# Altium schematic sheet Bridge & Switching.SchDoc: FER_TEMPLATE
size A4; Author: Leon Baždar; CompanyName: FER; Address1: Zagreb; SheetNumber: 5; SheetTotal: 7
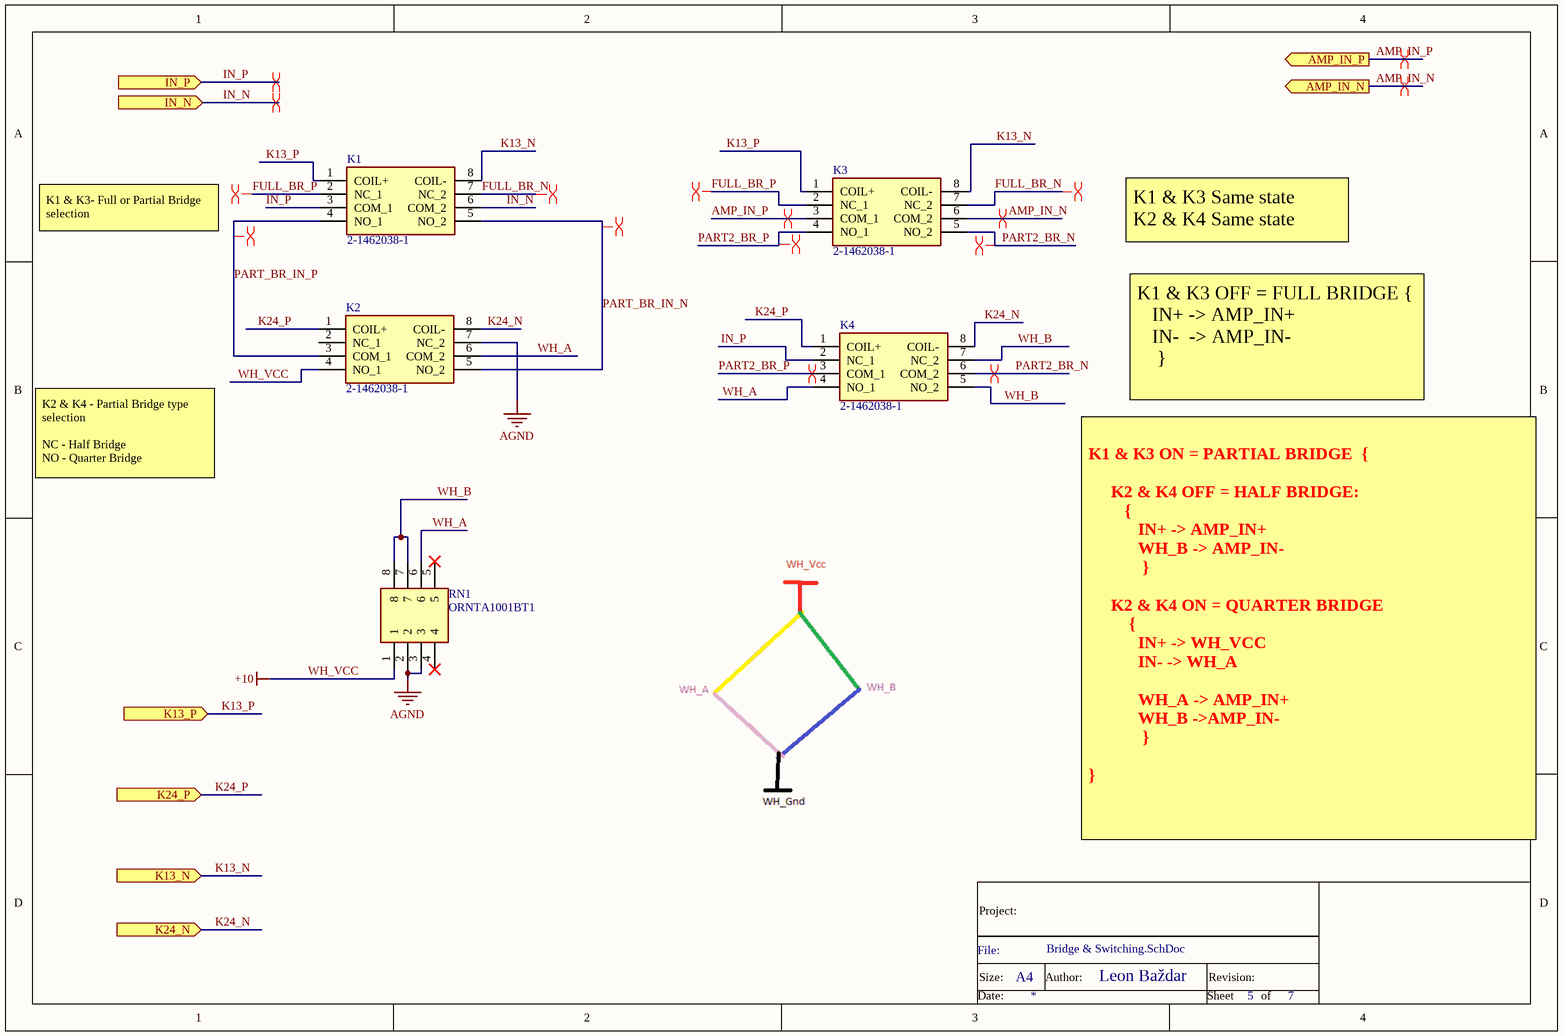
[diagram p0: Bridge & Switching.SchDoc]

## Parts
K1  2-1462038-1  [214620381]
K2  2-1462038-1  [214620381]
K3  2-1462038-1  [214620381]
K4  2-1462038-1  [214620381]
RN1  ORNTA1001BT1  [SOIC127P607X173-8N]

## Ports
AMP_IN_N (out), AMP_IN_P (out), IN_N (in), IN_P (in), K13_N (in), K13_P (in), K24_N (in), K24_P (in)

## Nets
AGND: K2.7(NC_2) RN1.2 RN1.3
WH_VCC: K2.4(NO_1) RN1.1  [also labelled +10]
AMP_IN_N: K3.6(COM_2) ; port AMP_IN_N
AMP_IN_P: K3.3(COM_1) ; port AMP_IN_P
FULL_BR_N: K1.7(NC_2) K3.7(NC_2)
FULL_BR_P: K1.2(NC_1) K3.2(NC_1)
IN_N: K1.6(COM_2) ; port IN_N
IN_P: K1.3(COM_1) K4.2(NC_1) ; port IN_P
K13_N: K1.8(COIL-) K3.8(COIL-) ; port K13_N
K13_P: K1.1(COIL+) K3.1(COIL+) ; port K13_P
K24_N: K2.8(COIL-) K4.8(COIL-) ; port K24_N
K24_P: K2.1(COIL+) K4.1(COIL+) ; port K24_P
PART2_BR_N: K3.5(NO_2) K4.6(COM_2)
PART2_BR_P: K3.4(NO_1) K4.3(COM_1)
PART_BR_IN_N: K1.5(NO_2) K2.5(NO_2)
PART_BR_IN_P: K1.4(NO_1) K2.3(COM_1)
WH_A: K2.6(COM_2) K4.4(NO_1) RN1.6
WH_B: K4.5(NO_2) K4.7(NC_2) RN1.7 RN1.8

Not connected (* = marked no-connect by the designer): K2 2(NC_1); RN1 4* 5*

## Layout directives
differential pair: AMP_IN_N, AMP_IN_P, FULL_BR_N, FULL_BR_P, IN_N, IN_P, PART2_BR_N, PART2_BR_P, PART_BR_IN_N, PART_BR_IN_P

## Notes on the sheet
- K1 & K3- Full or Partial Bridge selection
- K1 & K3 Same state
  K2 & K4 Same state
- K1 & K3 OFF = FULL BRIDGE {
  IN+ -> AMP_IN+
  IN-  -> AMP_IN-
  }
- K2 & K4 - Partial Bridge type selection
  NC - Half Bridge
  NO - Quarter Bridge
- K1 & K3 ON = PARTIAL BRIDGE  {
  K2 & K4 OFF = HALF BRIDGE:
  {
  IN+ -> AMP_IN+
  WH_B -> AMP_IN-
  }
  K2 & K4 ON = QUARTER BRIDGE
  {
  IN+ -> WH_VCC
  IN- -> WH_A
  WH_A -> AMP_IN+
  WH_B ->AMP_IN-
  }
  }
- Project:
- File:
- Size:
- A4
- Author:
- Revision:
- Date:
- Sheet
- of

## Library data of the parts
K1-K4 = 2-1462038-1: Relay or Contactor; Manufacturer_Name: TE Connectivity; Datasheet Link: https://www.te.com/commerce/DocumentDelivery/DDEController?Action=srchrtrv&DocNm=108-98001&DocType=Data+Sheet&DocLang=English&PartCntxt=2-1462038-1&DocFormat=pdf; Height: 5.8mm; Manufacturer_Part_Number: 2-1462038-1
RN1 = ORNTA1001BT1: Resistor Network; Manufacturer_Name: Vishay; Datasheet Link: https://www.vishay.com/docs/60005/orn.pdf; Height: 1.73mm; Manufacturer_Part_Number: ORNTA1001BT1; Mouser Part Number: 71-ORNTA1001BT1; Mouser Price/Stock: https://www.mouser.co.uk/ProductDetail/Vishay-Thin-Film/ORNTA1001BT1?qs=EiQZnNXpF8A9ZYJTqcYggA%3D%3D